# Altium schematic sheet Sensor Array.SchDoc
size A; SheetNumber: 2; SheetTotal: 3
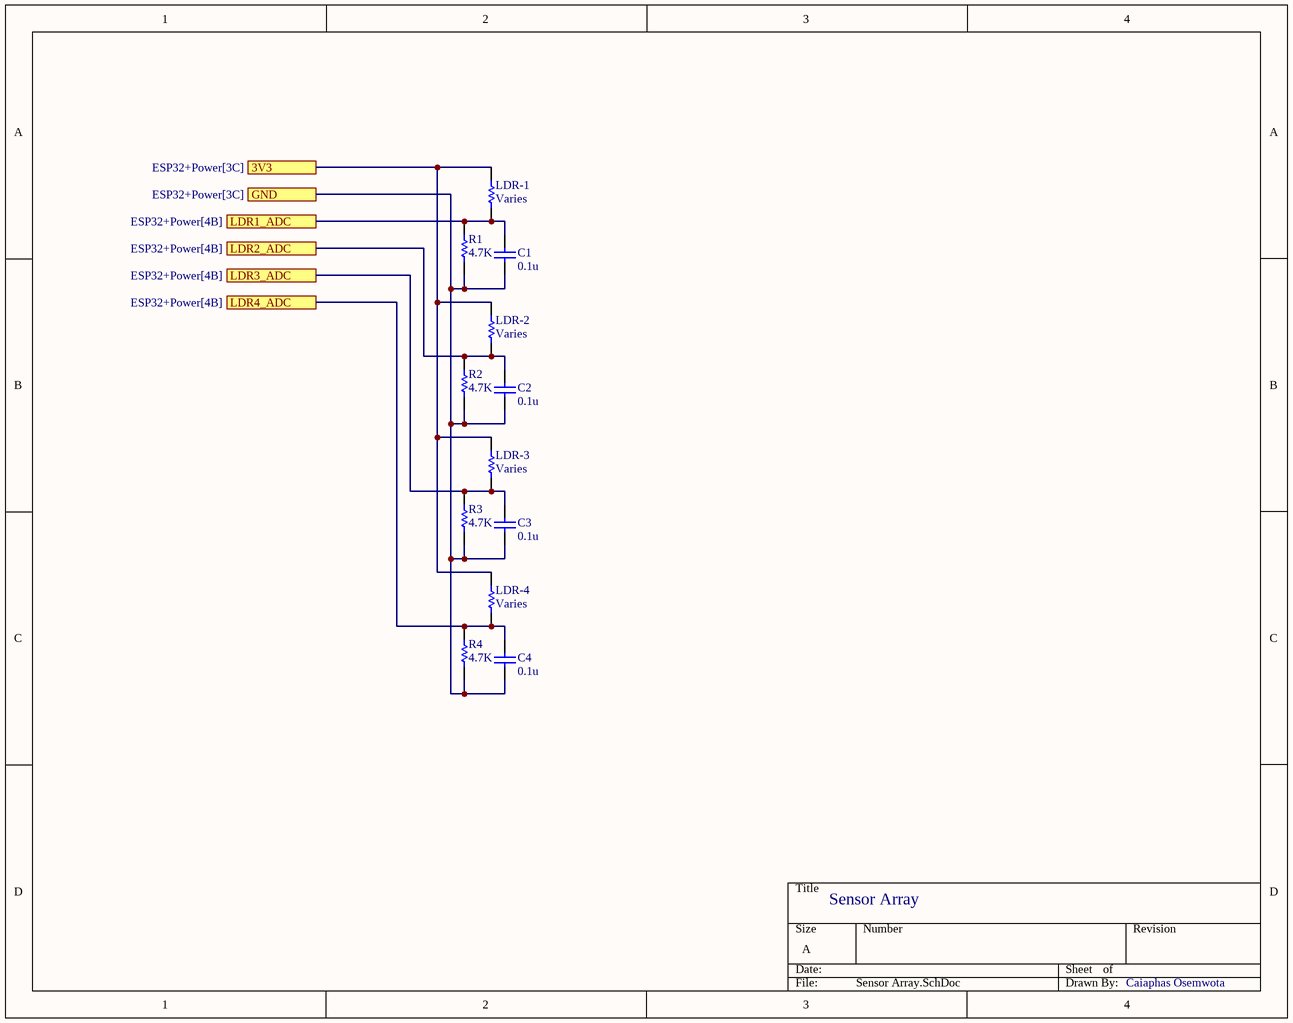
[diagram p0: Sensor Array.SchDoc]

## Parts
C1  value 0.1u  (hidden comment: Capacitor)
C2  value 0.1u  (hidden comment: Capacitor)
C3  value 0.1u  (hidden comment: Capacitor)
C4  value 0.1u  (hidden comment: Capacitor)
LDR-1  value Varies  (hidden comment: Resistor)
LDR-2  value Varies  (hidden comment: Resistor)
LDR-3  value Varies  (hidden comment: Resistor)
LDR-4  value Varies  (hidden comment: Resistor)
R1  value 4.7K  (hidden comment: Resistor)
R2  value 4.7K  (hidden comment: Resistor)
R3  value 4.7K  (hidden comment: Resistor)
R4  value 4.7K  (hidden comment: Resistor)

## Ports
3V3 (see ESP32+Power[3C]), GND (see ESP32+Power[3C]), LDR1_ADC (see ESP32+Power[4B]), LDR2_ADC (see ESP32+Power[4B]), LDR3_ADC (see ESP32+Power[4B]), LDR4_ADC (see ESP32+Power[4B])

## Nets
3V3: LDR-1.2 LDR-2.2 LDR-3.2 LDR-4.2 ; port 3V3
GND: C1.1 C2.1 C3.1 C4.1 R1.1 R2.1 R3.1 R4.1 ; port GND
LDR1_ADC: C1.2 LDR-1.1 R1.2 ; port LDR1_ADC
LDR2_ADC: C2.2 LDR-2.1 R2.2 ; port LDR2_ADC
LDR3_ADC: C3.2 LDR-3.1 R3.2 ; port LDR3_ADC
LDR4_ADC: C4.2 LDR-4.1 R4.2 ; port LDR4_ADC

## Notes on the sheet
- Sensor Array
- Caiaphas Osemwota

## Library data of the parts
C1-C4 = Capacitor: SimulationGenericComponent: True
LDR-1-LDR-4 R1-R4 = Resistor: TC1: 0; SimulationGenericComponent: True; TC2: 0